# Altium project DMX Interface DB.PrjPcb (part 5 of 5)
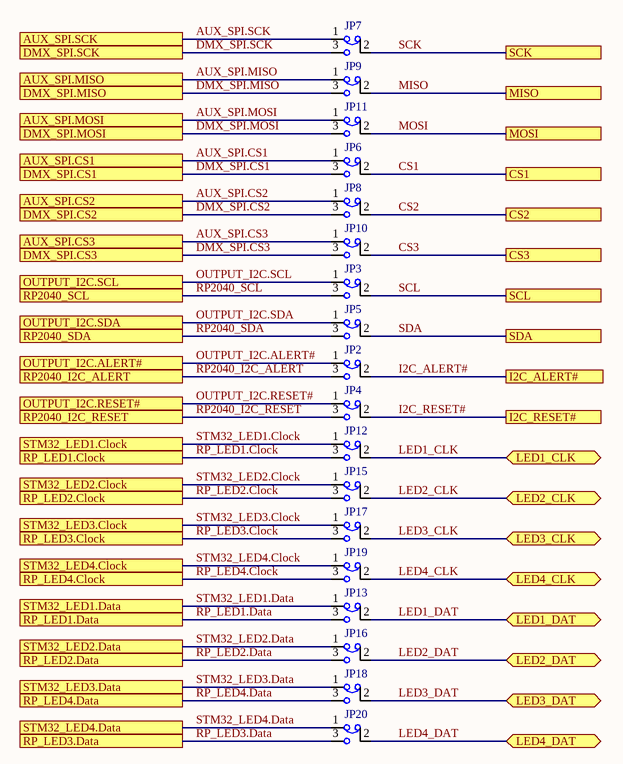
[diagram p14: Drive Select.SchDoc]

## Nets that join several sheets
3V3: Block Diagram (J22.09), DMX_RP2040 (6 pins), DMX (7 pins), RP2040 (R78.2 R80.2 R82.2 R84.2), LED_low_side_control (15 pins), Low Power LED Module/L (J9_L.05 J9_L.06), Microcontroller (C30.2 U11.3), STM32 (15 pins), SmartLED (9 pins), SL/S (J9_S.05 J9_S.06), LED_high_power (6 pins), HP_LED/H (J9_H.05 J9_H.06), Module Connector Female (J7.05 J7.06)
5V_RP2040: DMX_RP2040 (F2.1), RP2040 (U5.40)
5V_STM32: Microcontroller (F1.1), STM32 (U1.CN8_9 U1.CN11_18)
CHGND: DMX (J5.G J15.G), Microcontroller (R1.1)
GND: Block Diagram (J22.11), DMX_RP2040 (C28.2 C33.2 U12.2 U14.2), DMX (5 pins), RP2040 (11 pins), LED_low_side_control (19 pins), Low Power LED Module/PWM1 (C72_PWM1.2 J37_PWM1.5), Low Power LED Module/PWM2 (C72_PWM2.2 J37_PWM2.5), Low Power LED Module/PWM3 (C72_PWM3.2 J37_PWM3.5), Low Power LED Module/L (J9_L.03 J9_L.04 J9_L.07 J9_L.08), Low Power LED Module/PWM4 (C72_PWM4.2 J37_PWM4.5), Microcontroller (9 pins), STM32 (32 pins), SmartLED (43 pins), SL/S (J9_S.03 J9_S.04 J9_S.07 J9_S.08), LED_high_power (8 pins), HP_LED/H (J9_H.03 J9_H.04 J9_H.07 J9_H.08), HP_LED/HP1 (14 pins), HP_LED/HP2 (14 pins), HP_LED/HP3 (14 pins), HP_LED/HP4 (14 pins), Module Connector Female (J7.03 J7.04 J7.07 J7.08)
RP_VSYS: DMX_RP2040 (JP23.2 Q3.D U14.4), RP2040 (U5.39)
V_LED: DMX_RP2040 (JP22.2 Q2.D U12.4), LED_low_side_control (5 pins), Low Power LED Module/PWM1 (C72_PWM1.1 J37_PWM1.4), Low Power LED Module/PWM2 (C72_PWM2.1 J37_PWM2.4), Low Power LED Module/PWM3 (C72_PWM3.1 J37_PWM3.4), Low Power LED Module/L (J9_L.01 J9_L.02), Low Power LED Module/PWM4 (C72_PWM4.1 J37_PWM4.4), Microcontroller (5 pins), SmartLED (26 pins), SL/S (J9_S.01 J9_S.02), LED_high_power (5 pins), HP_LED/H (J9_H.01 J9_H.02), HP_LED/HP1 (C56_HP1.2 L10_HP1.1), HP_LED/HP2 (C56_HP2.2 L10_HP2.1), HP_LED/HP3 (C56_HP3.2 L10_HP3.1), HP_LED/HP4 (C56_HP4.2 L10_HP4.1), Module Connector Female (J7.01 J7.02)
AUX_SPI.CS1: STM32 (JP34.2), Drive Select (JP6.1)
AUX_SPI.CS2: STM32 (JP32.2), Drive Select (JP8.1)
AUX_SPI.CS3: STM32 (JP30.2), Drive Select (JP10.1)
AUX_SPI.MISO: STM32 (JP31.2), Drive Select (JP9.1)
AUX_SPI.MOSI: STM32 (JP29.2), Drive Select (JP11.1)
AUX_SPI.SCK: STM32 (JP33.2), Drive Select (JP7.1)
CS1: Module Connector Female (J11.05), Drive Select (JP6.2)
CS2: Module Connector Female (J11.07), Drive Select (JP8.2)
CS3: Module Connector Female (J11.09), Drive Select (JP10.2)
DISPLAY_IO.COL0: Microcontroller (J21.02), STM32 (U1.CN10_20 U1.CN12_44)
DISPLAY_IO.COL1: Microcontroller (J21.04), STM32 (U1.CN10_18 U1.CN12_40)
DISPLAY_IO.COL2: Microcontroller (J21.06), STM32 (U1.CN10_4 U1.CN12_52)
DISPLAY_IO.COL3: Microcontroller (J21.08), STM32 (U1.CN10_24 U1.CN12_47)
DISPLAY_IO.ROW0: Microcontroller (J21.01), STM32 (U1.CN12_65)
DISPLAY_IO.ROW1: Microcontroller (J21.03), STM32 (U1.CN10_23 U1.CN12_45)
DISPLAY_IO.ROW2: Microcontroller (J21.05), STM32 (U1.CN10_21 U1.CN12_43)
DISPLAY_IO.ROW3: Microcontroller (J21.07), STM32 (U1.CN10_19 U1.CN12_41)
DMX.EN: DMX (R12.1), RP2040 (U5.5)
DMX.RX: DMX (R14.1 U8.5), RP2040 (U5.4)
DMX.TX: DMX (R9.1), RP2040 (U5.6)
DMX_I2C.ALERT#: Block Diagram (J22.05), RP2040 (U5.7), STM32 (R28.1 U1.CN7_14 U1.CN12_29)
DMX_I2C.RESET#: Block Diagram (J22.07), RP2040 (U5.20), STM32 (R27.1 U1.CN10_34 U1.CN12_37)
DMX_I2C.SCL: Block Diagram (J22.01), RP2040 (U5.10), STM32 (R29.1 U1.CN7_2 U1.CN12_3)
DMX_I2C.SDA: Block Diagram (J22.03), RP2040 (U5.9), STM32 (R26.1 U1.CN7_4 U1.CN12_5)
DMX_SPI.CS1: Block Diagram (J22.08), RP2040 (U5.12), STM32 (JP34.3 U1.CN10_29 U1.CN11_28), Drive Select (JP6.3)
DMX_SPI.CS2: STM32 (JP32.3 U1.CN8_2), Drive Select (JP8.3)
DMX_SPI.CS3: STM32 (JP30.3 U1.CN7_19 U1.CN12_27), Drive Select (JP10.3)
DMX_SPI.MISO: Block Diagram (J22.04), RP2040 (SB2.1 SB6.1), STM32 (JP31.3 U1.CN9_1 U1.CN12_13), Drive Select (JP9.3)
DMX_SPI.MOSI: Block Diagram (J22.06), RP2040 (SB4.1 SB5.1), STM32 (JP29.3 U1.CN10_12 U1.CN12_61), Drive Select (JP11.3)
DMX_SPI.SCK: Block Diagram (J22.02), RP2040 (SB7.1), STM32 (JP33.3 U1.CN8_10 U1.CN11_3), Drive Select (JP7.3)
GPIO0: Microcontroller (J4.01), STM32 (U1.CN9_3 U1.CN11_38)
GPIO1: Microcontroller (J4.03), STM32 (U1.CN9_25 U1.CN11_57)
GPIO2: Microcontroller (J4.05), STM32 (U1.CN9_6 U1.CN11_41)
GPIO3: Microcontroller (J4.07), STM32 (U1.CN8_16 U1.CN11_44)
GPIO4: Microcontroller (J4.02), STM32 (U1.CN9_9 U1.CN11_35)
GPIO5: Microcontroller (J4.04), STM32 (U1.CN9_27 U1.CN11_55)
GPIO6: Microcontroller (J4.06), STM32 (U1.CN8_14 U1.CN11_42)
GPIO7: Microcontroller (J4.08), STM32 (U1.CN8_12 U1.CN11_4)
HP_SCL: LED_high_power (U21.6), HP_LED/H (J12_H.02)
HP_SDA: LED_high_power (U21.5), HP_LED/H (J12_H.04)
I2C_ALERT#: Module Connector Female (J11.01), Drive Select (JP2.2)
I2C_RESET#: Module Connector Female (J11.03), Drive Select (JP4.2)
LED1_CLK: SmartLED (J?#3.02 U10.9), SL/S (J17_S.02), Module Connector Female (J16.02), Drive Select (JP12.2)
LED1_DAT: SmartLED (J?#3.01 U10.8), SL/S (J17_S.01), Module Connector Female (J16.01), Drive Select (JP13.2)
LED2_CLK: SmartLED (J?#3.04 U10.7), SL/S (J17_S.04), Module Connector Female (J16.04), Drive Select (JP15.2)
LED2_DAT: SmartLED (J?#3.03 U10.6), SL/S (J17_S.03), Module Connector Female (J16.03), Drive Select (JP16.2)
LED3_CLK: SmartLED (J?#3.06 U10.5), SL/S (J17_S.06), Module Connector Female (J16.06), Drive Select (JP17.2)
LED3_DAT: SmartLED (J?#3.05 U10.4), SL/S (J17_S.05), Module Connector Female (J16.05), Drive Select (JP18.2)
LED4_CLK: SmartLED (J?#3.08 U10.3), SL/S (J17_S.08), Module Connector Female (J16.08), Drive Select (JP19.2)
LED4_DAT: SmartLED (J?#3.07 U10.2), SL/S (J17_S.07), Module Connector Female (J16.07), Drive Select (JP20.2)
LEDn1: LED_high_power (J33.4), HP_LED/HP1 (6 pins)
LEDn2: LED_high_power (J33.3), HP_LED/HP2 (6 pins)
LEDn3: LED_high_power (J33.2), HP_LED/HP3 (6 pins)
LEDn4: LED_high_power (J33.1), HP_LED/HP4 (6 pins)
LEDp1: LED_high_power (J33.8), HP_LED/HP1 (14 pins)
LEDp2: LED_high_power (J33.7), HP_LED/HP2 (14 pins)
LEDp3: LED_high_power (J33.6), HP_LED/HP3 (14 pins)
LEDp4: LED_high_power (J33.5), HP_LED/HP4 (14 pins)
LP_RESET#: LED_low_side_control (SB1.1), Low Power LED Module/L (J12_L.03)
LP_SCL: LED_low_side_control (U15.6 U20.26), Low Power LED Module/L (J12_L.02)
LP_SDA: LED_low_side_control (U15.5 U20.27), Low Power LED Module/L (J12_L.04)
MISO: Module Connector Female (J11.08), Drive Select (JP9.2)
MOSI: Module Connector Female (J11.10), Drive Select (JP11.2)
NetJ17_H_01: LED_high_power (JP26.3), HP_LED/H (J17_H.01)
NetJ17_H_02: LED_high_power (JP26.1), HP_LED/H (J17_H.02)
OUTPUT_I2C.ALERT#: STM32 (R85.1 U1.CN10_9 U1.CN12_57), Drive Select (JP2.1)
OUTPUT_I2C.RESET#: STM32 (R81.1 U1.CN10_11 U1.CN12_50), Drive Select (JP4.1)
OUTPUT_I2C.SCL: STM32 (R83.1 U1.CN12_36), Drive Select (JP3.1)
OUTPUT_I2C.SDA: STM32 (R79.1 U1.CN12_60), Drive Select (JP5.1)
PWM1: LED_high_power (JP26.2), HP_LED/HP1 (U19_HP1.3)
PWM1_B: LED_low_side_control (U20.8), Low Power LED Module/PWM1 (J37_PWM1.1)
PWM1_G: LED_low_side_control (U20.7), Low Power LED Module/PWM1 (J37_PWM1.2)
PWM1_R: LED_low_side_control (U20.6), Low Power LED Module/PWM1 (J37_PWM1.3)
PWM1_YW: LED_low_side_control (U20.9), Low Power LED Module/PWM1 (J37_PWM1.6)
PWM2: HP_LED/H (J17_H.03), HP_LED/HP2 (U19_HP2.3)
PWM2_B: LED_low_side_control (U20.13), Low Power LED Module/PWM2 (J37_PWM2.1)
PWM2_G: LED_low_side_control (U20.12), Low Power LED Module/PWM2 (J37_PWM2.2)
PWM2_R: LED_low_side_control (U20.11), Low Power LED Module/PWM2 (J37_PWM2.3)
PWM2_YW: LED_low_side_control (U20.14), Low Power LED Module/PWM2 (J37_PWM2.6)
PWM3: HP_LED/H (J17_H.05), HP_LED/HP3 (U19_HP3.3)
PWM3_B: LED_low_side_control (U20.17), Low Power LED Module/PWM3 (J37_PWM3.1)
PWM3_G: LED_low_side_control (U20.16), Low Power LED Module/PWM3 (J37_PWM3.2)
PWM3_R: LED_low_side_control (U20.15), Low Power LED Module/PWM3 (J37_PWM3.3)
PWM3_YW: LED_low_side_control (U20.18), Low Power LED Module/PWM3 (J37_PWM3.6)
PWM4: HP_LED/H (J17_H.07), HP_LED/HP4 (U19_HP4.3)
PWM4_B: LED_low_side_control (U20.22), Low Power LED Module/PWM4 (J37_PWM4.1)
PWM4_G: LED_low_side_control (U20.21), Low Power LED Module/PWM4 (J37_PWM4.2)
PWM4_R: LED_low_side_control (U20.20), Low Power LED Module/PWM4 (J37_PWM4.3)
PWM4_YW: LED_low_side_control (U20.23), Low Power LED Module/PWM4 (J37_PWM4.6)
RP2040_I2C_ALERT: RP2040 (R84.1 U5.19), Drive Select (JP2.3)
RP2040_I2C_RESET: RP2040 (R80.1 U5.2), Drive Select (JP4.3)
RP2040_RST#: RP2040 (J14.2 U5.30), STM32 (U1.CN9_30)
RP2040_SCL: RP2040 (R82.1 U5.17), Drive Select (JP3.3)
RP2040_SDA: RP2040 (R78.1 U5.16), Drive Select (JP5.3)
RP_LED1.Clock: RP2040 (U5.24), Drive Select (JP12.3)
RP_LED1.Data: RP2040 (U5.25), Drive Select (JP13.3)
RP_LED2.Clock: RP2040 (U5.21), Drive Select (JP15.3)
RP_LED2.Data: RP2040 (U5.22), Drive Select (JP16.3)
RP_LED3.Clock: RP2040 (U5.26), Drive Select (JP17.3)
RP_LED3.Data: RP2040 (U5.27), Drive Select (JP20.3)
RP_LED4.Clock: RP2040 (SB8.1), Drive Select (JP19.3)
RP_LED4.Data: RP2040 (SB3.1), Drive Select (JP18.3)
SCK: Module Connector Female (J11.06), Drive Select (JP7.2)
SCL: Module Connector Female (J11.02), Drive Select (JP3.2)
SDA: Module Connector Female (J11.04), Drive Select (JP5.2)
SmartLED_SCL: SmartLED (U13.6), SL/S (J12_S.02)
SmartLED_SDA: SmartLED (U13.5), SL/S (J12_S.04)
STM32_LED1.Clock: STM32 (U1.CN7_10 U1.CN12_11), Drive Select (JP12.1)
STM32_LED1.Data: STM32 (U1.CN9_2 U1.CN11_45), Drive Select (JP13.1)
STM32_LED2.Clock: STM32 (U1.CN10_32 U1.CN12_25), Drive Select (JP15.1)
STM32_LED2.Data: STM32 (U1.CN9_5 U1.CN11_37), Drive Select (JP16.1)
STM32_LED3.Clock: STM32 (U1.CN8_6 U1.CN11_1), Drive Select (JP17.1)
STM32_LED3.Data: STM32 (U1.CN10_15 U1.CN12_22), Drive Select (JP18.1)
STM32_LED4.Clock: STM32 (U1.CN10_26 U1.CN12_49), Drive Select (JP19.1)
STM32_LED4.Data: STM32 (U1.CN10_8 U1.CN12_51), Drive Select (JP20.1)

## Assembly variants
Production: not fitted J40 J51 SB3 SB4 SB6 SB8